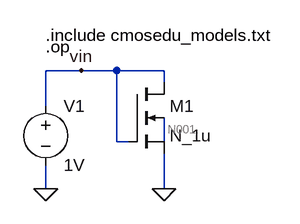
[diagram p0: schematic Circuito-3a.asc]
Circuito-3a.asc, the LTspice schematic file:
Version 4
SHEET 1 880 680
WIRE 64 64 16 64
WIRE 112 64 64 64
WIRE 176 64 112 64
WIRE 176 80 176 64
WIRE 16 112 16 64
WIRE 112 160 112 64
WIRE 128 160 112 160
WIRE 176 160 176 128
WIRE 16 224 16 192
WIRE 176 224 176 176
FLAG 16 224 0
FLAG 176 224 0
FLAG 64 64 vin
SYMBOL voltage 16 96 R0
WINDOW 123 0 0 Left 2
WINDOW 39 0 0 Left 2
SYMATTR InstName V1
SYMATTR Value 1V
SYMBOL nmos4 128 80 R0
SYMATTR InstName M1
SYMATTR Value N_1u
SYMATTR Value2 l=1.5u w=3u
TEXT 16 16 Left 2 !.include cmosedu_models.txt
TEXT 16 32 Left 2 !.op

The netlist it stands for:
* Circuito-3a.asc
V1 vin 0 1V
M1 vin vin 0 N001 N_1u l=1.5u w=3u
.model NMOS NMOS
.model PMOS PMOS
.lib standard.mos
.include cmosedu_models.txt
.op
.backanno
.end

* Results of the author's LTspice run, read from the files saved beside the schematic
* Operating Point:
*   V(vin) = 1 V
*   V(n001) = 113.1 mV
*   Id(M1) = 4.324 µA
*   Ig(M1) = 0 A
*   Ib(M1) = 0 A
*   Is(M1) = -4.324 µA
*   I(V1) = -4.324 µA
* From the log:
*   Semiconductor Device Operating Points:
*                           --- MOSFET Transistors ---
*   Name:          m1
*   Model:        n_1u
*   Id:          4.32e-06
*   Vgs:         1.00e+00
*   Vds:         1.00e+00
*   Vbs:         1.13e-01
*   Vth:         8.54e-01
*   Vdsat:       1.58e-01
*   Gm:          4.04e-05
*   Gds:         2.45e-07
*   Gmb:         1.26e-05
*   Cbd:         0.00e+00
*   Cbs:         0.00e+00
*   Cgsov:       6.00e-16
*   Cgdov:       6.00e-16
*   Cgbov:       1.30e-16
*   Cgs:         4.49e-15
*   Cgd:         0.00e+00
*   Cgb:         0.00e+00